# EAGLE design Bhoreal mini (EAGLE 7.7.0)

## Sheet 1 of 2
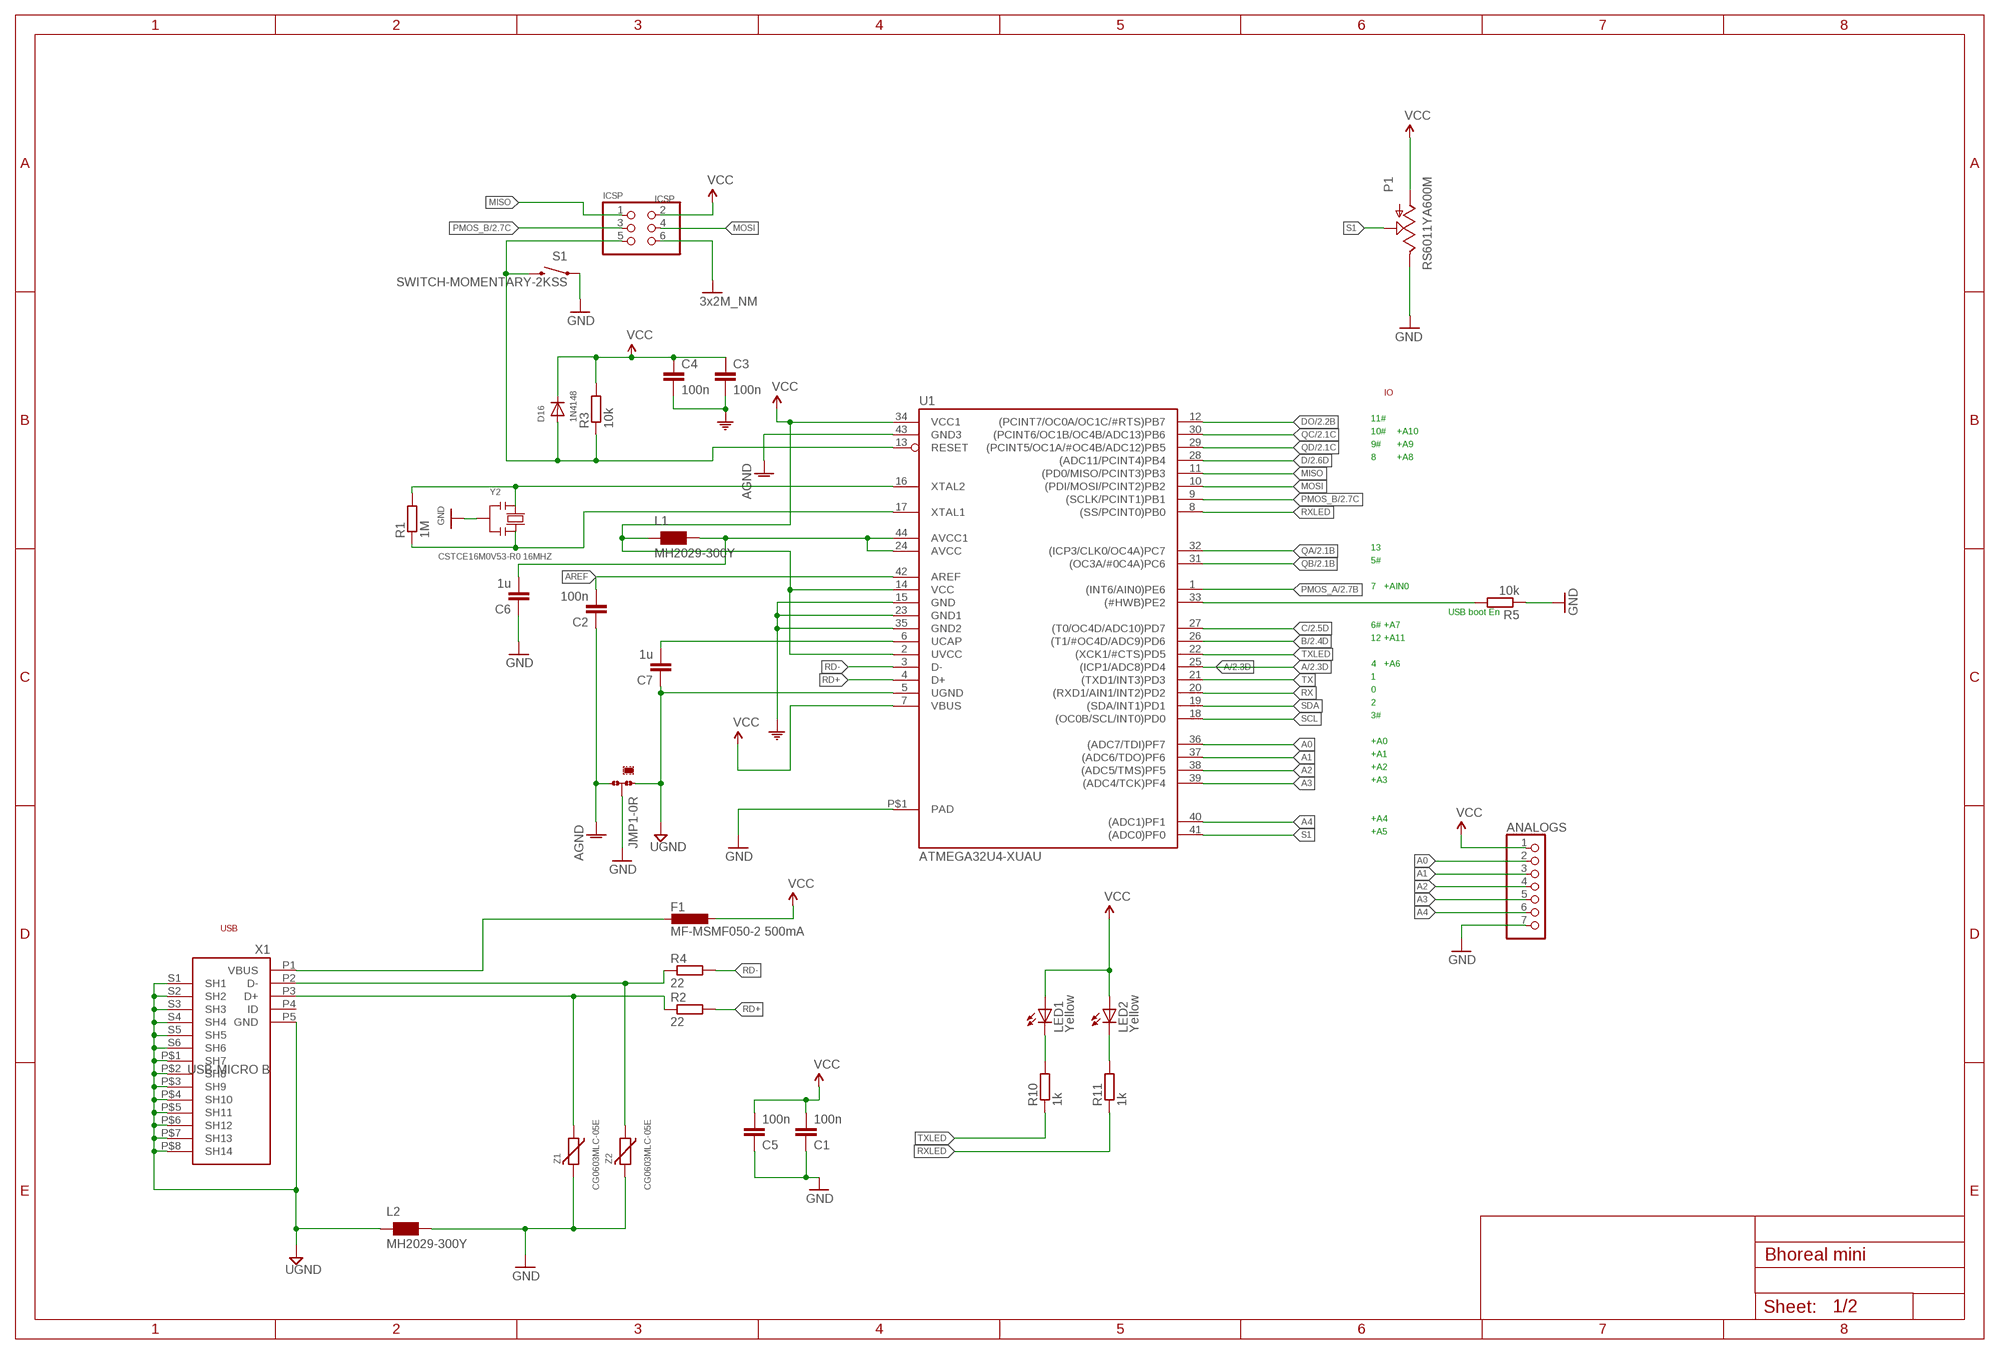
[diagram p0: schematic, sheet 1]

### Parts
ANALOGS  PINHD-1X7  [1X07]
C1  100n  C-EUC0603K  [C0603K]
C2  100n  C-EUC0603K  [C0603K]
C3  100n  C-EUC0603K  [C0603K]
C4  100n  C-EUC0603K  [C0603K]
C5  100n  C-EUC0603K  [C0603K]
C6  1u  C-EUC0805  [C0805]
C7  1u  C-EUC0805  [C0805]
D16  1N4148  DIODESOD-323F  [SOD-323F]
F1  MF-MSMF050-2 500mA  L-EUL1812  [L1812]
ICSP  ICSP  PINHD-2X3  [2X03]
JMP1  0R-JUMPC  [C0R-JMP]
L1  MH2029-300Y  WE-CBF_0805  [0805]
L2  MH2029-300Y  WE-CBF_0805  [0805]
LED1  Yellow  LEDCHIPLED_0805  [CHIPLED_0805]
LED2  Yellow  LEDCHIPLED_0805  [CHIPLED_0805]
P1  RS6011YA600M  [RS6011YA600M]
R1  1M  R-EU_R0603  [R0603]
R2  22  R-EU_R0603  [R0603]
R3  10k  R-EU_R0603  [R0603]
R4  22  R-EU_R0603  [R0603]
R5  10k  R-EU_R0603  [R0603]
R10  1k  R-EU_R0603  [R0603]
R11  1k  R-EU_R0603  [R0603]
S1  SWITCH-MOMENTARY-2KSS  [KSS241G]
U1  ATMEGA32U4-XUAU  [TQFP44-PAD]
X1  USB-MICRO B  MYCON2_USB-MINI-B  [CON2_USB_MICRO_B_AT]
Y2  CSTCE16M0V53-R0 16MHZ  RESONATORMU  [RESONATOR]
Z1  CG0603MLC-05E  VARISTORCN0603  [CT/CN0603]
Z2  CG0603MLC-05E  VARISTORCN0603  [CT/CN0603]

### Nets
A: U1.25((ICP1/ADC8)PD4) ; also sheet 2
A0: ANALOGS.2 U1.36((ADC7/TDI)PF7)
A1: ANALOGS.3 U1.37((ADC6/TDO)PF6)
A2: ANALOGS.4 U1.38((ADC5/TMS)PF5)
A3: ANALOGS.5 U1.39((ADC4/TCK)PF4)
A4: ANALOGS.6 U1.40((ADC1)PF1)
AGND: C2.1 JMP1.3 U1.43(GND3)
AREF [aref]: C2.2 U1.42(AREF)
AVCC: C6.2 L1.2 U1.24(AVCC) U1.44(AVCC1)
B: U1.26((T1/#OC4D/ADC9)PD6) ; also sheet 2
C: U1.27((T0/OC4D/ADC10)PD7) ; also sheet 2
D: U1.28((ADC11/PCINT4)PB4) ; also sheet 2
D+: R2.1 X1.P3(D+) Z1.1
D-: R4.1 X1.P2(D-) Z2.1
DO: U1.12((PCINT7/OC0A/OC1C/#RTS)PB7) ; also sheet 2
GND: ANALOGS.7 C1.1 C3.2 C4.2 C5.1 C6.1 ICSP.6 JMP1.2 L2.2 P1.2(E) R5.1 S1.1 U1.15(GND) U1.23(GND1) U1.35(GND2) U1.P$1(PAD) Y2.2 Z1.2 Z2.2 ; supply symbol labelled 3x2M_NM, COM ; also sheet 2
HWB: R5.2 U1.33((#HWB)PE2)
MISO: ICSP.1 U1.11((PD0/MISO/PCINT3)PB3)
MOSI: ICSP.4 U1.10((PDI/MOSI/PCINT2)PB2)
N$2 [usbvcc]: LED1.C R10.2
N$4 [usbvcc]: LED2.C R11.2
PMOS_A: U1.1((INT6/AIN0)PE6) ; also sheet 2
PMOS_B: ICSP.3 U1.9((SCLK/PCINT1)PB1) ; also sheet 2
QA: U1.32((ICP3/CLK0/OC4A)PC7) ; also sheet 2
QB: U1.31((OC3A/#0C4A)PC6) ; also sheet 2
QC: U1.30((PCINT6/OC1B/OC4B/ADC13)PB6) ; also sheet 2
QD: U1.29((PCINT5/OC1A/#OC4B/ADC12)PB5) ; also sheet 2
RD+: R2.2 U1.4(D+)
RD-: R4.2 U1.3(D-)
RESET: D16.A ICSP.5 R3.1 S1.2 U1.13(RESET)
RX: U1.20((RXD1/AIN1/INT2)PD2)
RXLED: R11.1 U1.8((SS/PCINT0)PB0)
S1: P1.1(S) U1.41((ADC0)PF0)
SCL: U1.18((OC0B/SCL/INT0)PD0)
SDA: U1.19((SDA/INT1)PD1)
TX: U1.21((TXD1/INT3)PD3)
TXLED: R10.1 U1.22((XCK1/#CTS)PD5)
UCAP: C7.2 U1.6(UCAP)
UGND [gnd]: C7.1 JMP1.1 L2.1 U1.5(UGND) X1.P5(GND) X1.P$1(SH7) X1.P$2(SH8) X1.P$3(SH9) X1.P$4(SH10) X1.P$5(SH11) X1.P$6(SH12) X1.P$7(SH13) X1.P$8(SH14) X1.S1(SH1) X1.S2(SH2) X1.S3(SH3) X1.S4(SH4) X1.S5(SH5) X1.S6(SH6)
VCC: ANALOGS.1 C1.2 C3.1 C4.1 C5.2 D16.C F1.1 ICSP.2 L1.1 LED1.A LED2.A P1.3(A) R3.2 U1.2(UVCC) U1.7(VBUS) U1.14(VCC) U1.34(VCC1) ; also sheet 2
XTAL3: R1.2 U1.16(XTAL2) Y2.1
XTAL4: R1.1 U1.17(XTAL1) Y2.3
XUSB [usbvcc]: F1.2 X1.P1(VBUS)
Unconnected: X1.P4(ID)

### Notes on the sheet
- IO
- 11#
- 10# | +A10
- 9# | +A9
- 8 | +A8
- 13
- 5#
- 7 | +AIN0
- USB boot En
- 6# | +A7
- 12 | +A11
- 4 | +A6
- 1
- 0
- 2
- 3#
- +A0
- +A1
- +A2
- +A3
- +A4
- +A5
- USB

## Sheet 2 of 2
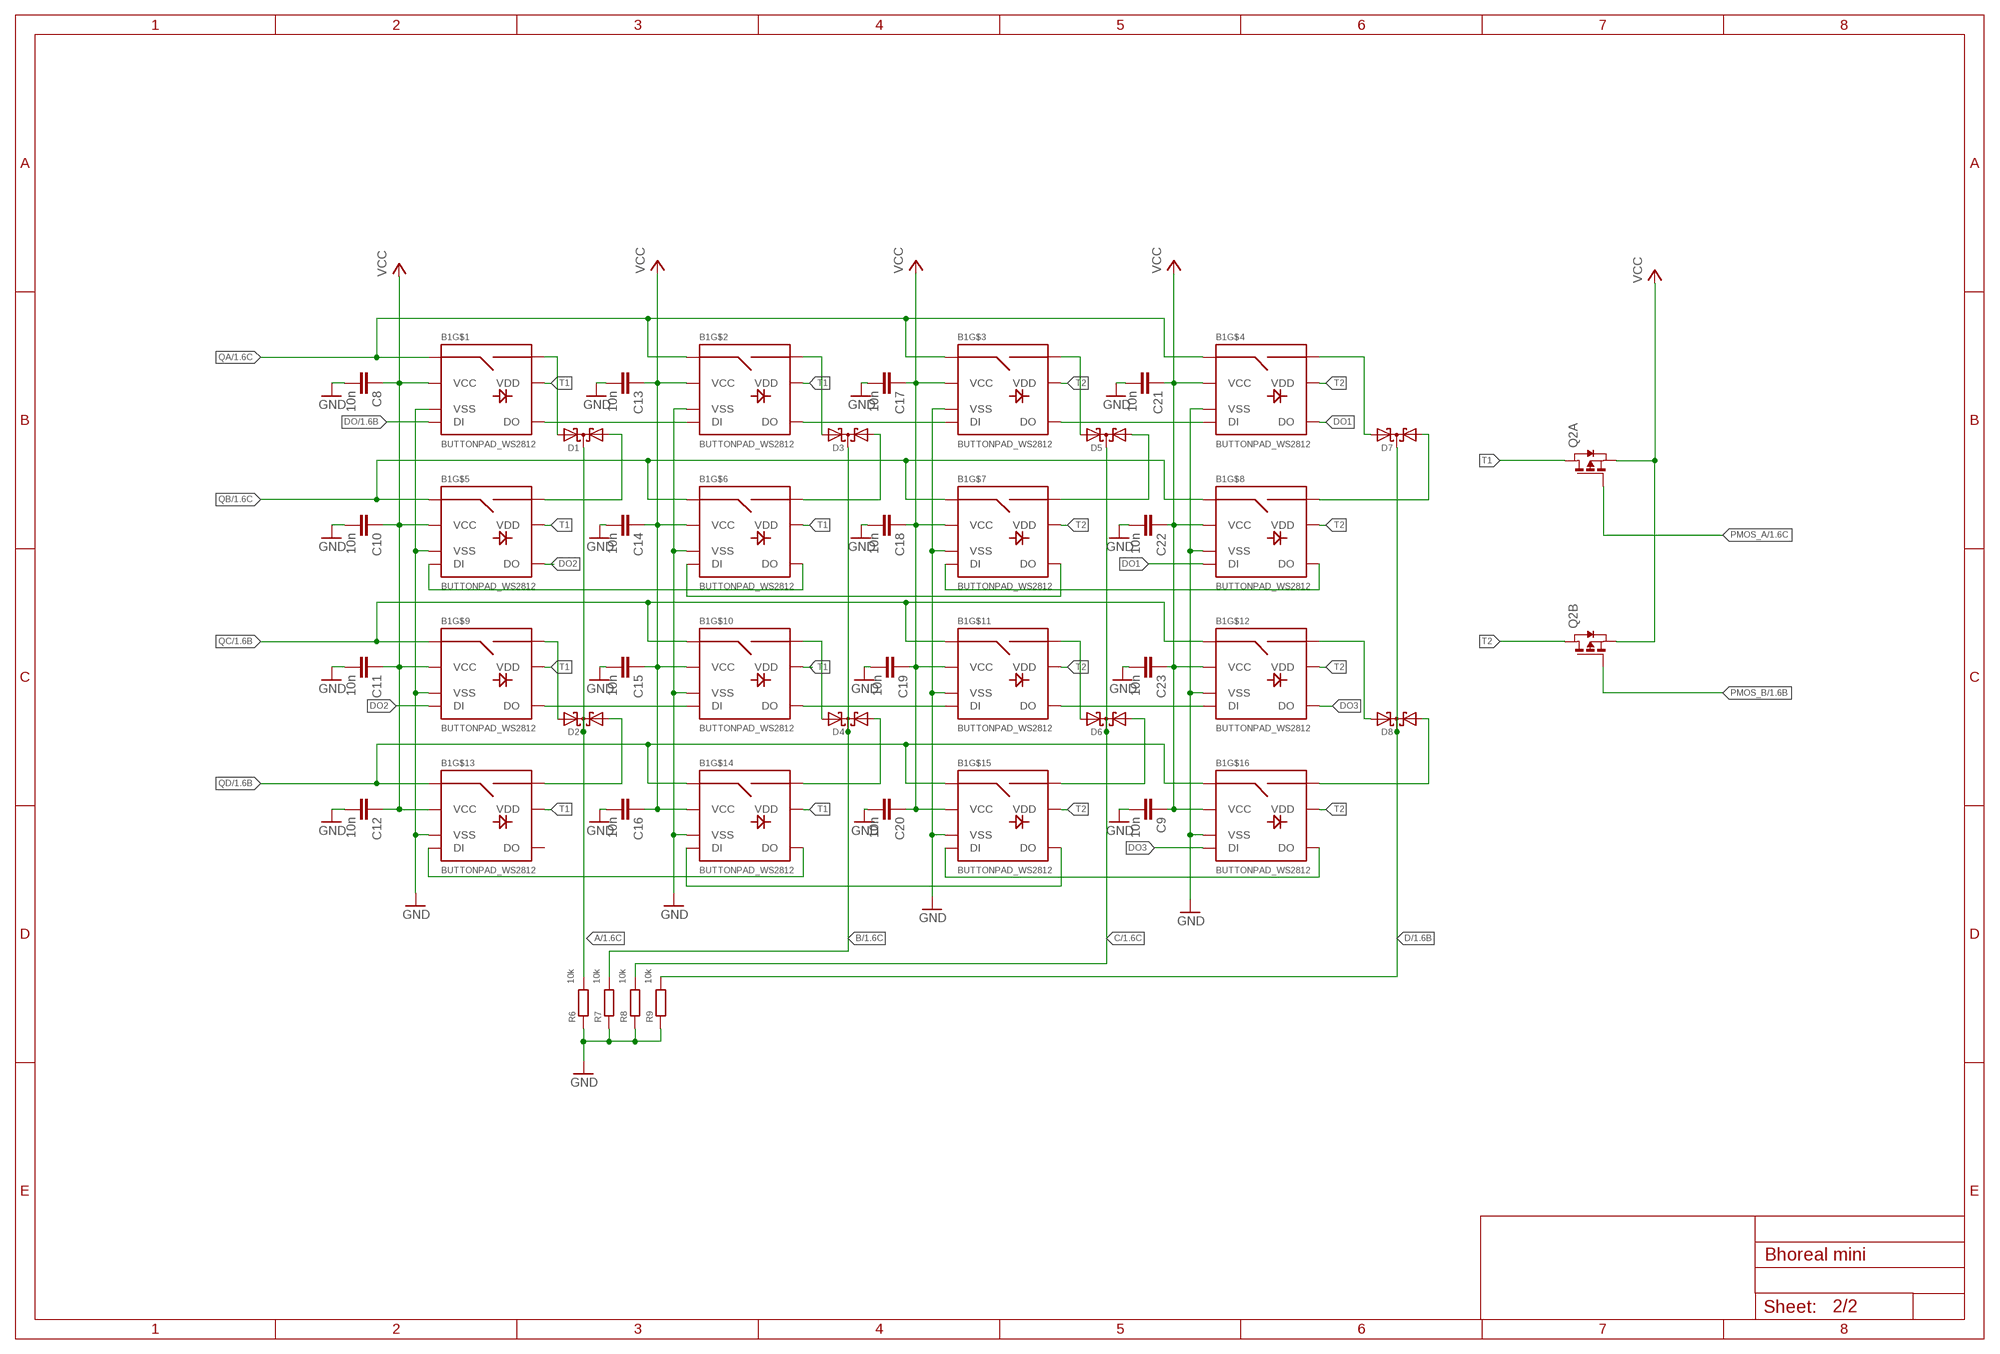
[diagram p1: schematic, sheet 2]

### Parts
B1  BUTTONPAD_WS2812  [BUTTONPAD_WS2812]
C8  10n  C-EUC0603  [C0603]
C9  10n  C-EUC0603  [C0603]
C10  10n  C-EUC0603  [C0603]
C11  10n  C-EUC0603  [C0603]
C12  10n  C-EUC0603  [C0603]
C13  10n  C-EUC0603  [C0603]
C14  10n  C-EUC0603  [C0603]
C15  10n  C-EUC0603  [C0603]
C16  10n  C-EUC0603  [C0603]
C17  10n  C-EUC0603  [C0603]
C18  10n  C-EUC0603  [C0603]
C19  10n  C-EUC0603  [C0603]
C20  10n  C-EUC0603  [C0603]
C21  10n  C-EUC0603  [C0603]
C22  10n  C-EUC0603  [C0603]
C23  10n  C-EUC0603  [C0603]
D1  BAS70-05  [SOT23]
D2  BAS70-05  [SOT23]
D3  BAS70-05  [SOT23]
D4  BAS70-05  [SOT23]
D5  BAS70-05  [SOT23]
D6  BAS70-05  [SOT23]
D7  BAS70-05  [SOT23]
D8  BAS70-05  [SOT23]
Q2  PMOS2SO8  [SO8]
R6  10k  R-EU_R0603  [R0603]
R7  10k  R-EU_R0603  [R0603]
R8  10k  R-EU_R0603  [R0603]
R9  10k  R-EU_R0603  [R0603]

### Nets
A: D1.3(C) D2.3(C) R6.2 ; also sheet 1
B: D3.3(C) D4.3(C) R7.2 ; also sheet 1
C: D5.3(C) D6.3(C) R8.2 ; also sheet 1
D: D7.3(C) D8.3(C) R9.2 ; also sheet 1
DO: B1.2A(DI) ; also sheet 1
DO1: B1.1D(DO) B1.2H(DI)
DO2: B1.1E(DO) B1.2I(DI)
DO3: B1.1L(DO) B1.2P(DI)
GND: B1.6A(VSS) B1.6B(VSS) B1.6C(VSS) B1.6D(VSS) B1.6E(VSS) B1.6F(VSS) B1.6G(VSS) B1.6H(VSS) B1.6I(VSS) B1.6J(VSS) B1.6K(VSS) B1.6L(VSS) B1.6M(VSS) B1.6N(VSS) B1.6O(VSS) B1.6P(VSS) C8.2 C9.2 C10.2 C11.2 C12.2 C13.2 C14.2 C15.2 C16.2 C17.2 C18.2 C19.2 C20.2 C21.2 C22.2 C23.2 R6.1 R7.1 R8.1 R9.1 ; also sheet 1
N$1: B1.SIG2A(SIG2) D1.2(A2)
N$3: B1.SIG2E(SIG2) D1.1(A1)
N$5: B1.SIG2I(SIG2) D2.2(A2)
N$6: B1.SIG2M(SIG2) D2.1(A1)
N$7: B1.SIG2B(SIG2) D3.2(A2)
N$8: B1.SIG2F(SIG2) D3.1(A1)
N$9: B1.SIG2J(SIG2) D4.2(A2)
N$10: B1.SIG2N(SIG2) D4.1(A1)
N$11: B1.SIG2C(SIG2) D5.2(A2)
N$12: B1.SIG2G(SIG2) D5.1(A1)
N$13: B1.SIG2K(SIG2) D6.2(A2)
N$14: B1.SIG2O(SIG2) D6.1(A1)
N$15: B1.SIG2L(SIG2) D8.2(A2)
N$16: B1.SIG2P(SIG2) D8.1(A1)
N$17: B1.SIG2D(SIG2) D7.2(A2)
N$18: B1.SIG2H(SIG2) D7.1(A1)
N$19: B1.1A(DO) B1.2B(DI)
N$20: B1.1F(DO) B1.2E(DI)
N$21: B1.1G(DO) B1.2F(DI)
N$22: B1.1B(DO) B1.2C(DI)
N$23: B1.1C(DO) B1.2D(DI)
N$24: B1.1H(DO) B1.2G(DI)
N$25: B1.1K(DO) B1.2L(DI)
N$26: B1.1J(DO) B1.2K(DI)
N$27: B1.1I(DO) B1.2J(DI)
N$28: B1.1P(DO) B1.2O(DI)
N$29: B1.1O(DO) B1.2N(DI)
N$30: B1.1N(DO) B1.2M(DI)
PMOS_A: Q2.2(A:G) ; also sheet 1
PMOS_B: Q2.4(B:G) ; also sheet 1
QA: B1.SIG1A(SIG1) B1.SIG1B(SIG1) B1.SIG1C(SIG1) B1.SIG1D(SIG1) ; also sheet 1
QB: B1.SIG1E(SIG1) B1.SIG1F(SIG1) B1.SIG1G(SIG1) B1.SIG1H(SIG1) ; also sheet 1
QC: B1.SIG1I(SIG1) B1.SIG1J(SIG1) B1.SIG1K(SIG1) B1.SIG1L(SIG1) ; also sheet 1
QD: B1.SIG1M(SIG1) B1.SIG1N(SIG1) B1.SIG1O(SIG1) B1.SIG1P(SIG1) ; also sheet 1
T1: B1.5A(VDD) B1.5B(VDD) B1.5E(VDD) B1.5F(VDD) B1.5I(VDD) B1.5J(VDD) B1.5M(VDD) B1.5N(VDD) Q2.7(A:D) Q2.8(A:D)
T2: B1.5C(VDD) B1.5D(VDD) B1.5G(VDD) B1.5H(VDD) B1.5K(VDD) B1.5L(VDD) B1.5O(VDD) B1.5P(VDD) Q2.5(B:D) Q2.6(B:D)
VCC: B1.3A(VCC) B1.3B(VCC) B1.3C(VCC) B1.3D(VCC) B1.3E(VCC) B1.3F(VCC) B1.3G(VCC) B1.3H(VCC) B1.3I(VCC) B1.3J(VCC) B1.3K(VCC) B1.3L(VCC) B1.3M(VCC) B1.3N(VCC) B1.3O(VCC) B1.3P(VCC) C8.1 C9.1 C10.1 C11.1 C12.1 C13.1 C14.1 C15.1 C16.1 C17.1 C18.1 C19.1 C20.1 C21.1 C22.1 C23.1 Q2.1(A:S) Q2.3(B:S) ; also sheet 1
Unconnected: B1.1M(DO)

## Library data of the parts
ANALOGS = pinhead:PINHD-1X7: PIN HEADER
B1 = Hangar:BUTTONPAD_WS2812
C1-C7 = SmartPrj:C-EU: CAPACITOR, European symbol
C8-C23 = rcl:C-EU: CAPACITOR, European symbol
D1-D8 = diode:BAS70-05: Silicon Schottky Diodes General-purpose diode for high-speed switching
D16 = adafruit:DIODE: Diode SMADIODE - SMA Surface Mount Package 20V 1A Schottky Diode Digikey: 641-1014-6-ND DO-1N4148 - Through Hole Small Current Diode SOD-123 20V 1 A (.5mV Vf) Schottky Diode - Digikey: MBRX120TPMSCT-ND SOD-323 10V 570mA (.38mV Vf, 3ns) Schottky Diode - Digikey: ZLLS410CT-ND SOD-523 30V 30mA Schottky Diode (RB751S-40TE61) - Digikey: RB751S-40TE61CT-ND SOT23-R/W - SOT23 Package (R = Solder Paste/Reflow Ovens, W = Hand-Soldering) BAT54Film 40V 300mA - Digikey: 497-7162-1-ND
F1 = rcl:L-EU: INDUCTOR, European symbol
ICSP = SmartPrj:PINHD-2X3: PIN HEADER
JMP1 = Hangar:0R-JUMP: SMD 0R 0805 Jumper
L1 L2 = wuerth-elektronik:WE-CBF: SMD EMI Suppression Ferrite Beads - excellent anti-EMI properties - low DCR - impedances till 3000 ohms - rated current up to 6 A
LED1 LED2 = led:LED: LED OSRAM: - CHIPLED LG R971, LG N971, LY N971, LG Q971, LY Q971, LO R971, LY R971 LH N974, LH R974 LS Q976, LO Q976, LY Q976 LO Q996 - Hyper CHIPLED LW Q18S LB Q993, LB Q99A, LB R99A - SideLED LS A670, LO A670, LY A670, LG A670, LP A670 LB A673, LV A673, LT A673, LW A673 LH A674 LY A675 LS A676, LA A676, LO A676, LY A676, LW A676 LS A679, LY A679, LG A679 - Hyper Micro SIDELED® LS Y876, LA Y876, LO Y876, LY Y876 LT Y87S - SmartLED LW L88C, LW L88S LB L89C, LB L89S, LG L890 LS L89K, LO L89K, LY L89K LS L896, LA L896, LO L896, LY L896 - TOPLED LS T670, LO T670, LY T670, LG T670, LP T670 LSG T670, LSP T670, LSY T670, LOP T670, LYG T670 LG T671, LOG T671, LSG T671 LB T673, LV T673, LT T673, LW T673 LH T674 LS T676, LA T676, LO T676, LY T676, LB T676, LH T676, LSB T676, LW T676 LB T67C, LV T67C, LT T67C, LS T67K, LO T67K, LY T67K, LW E67C LS E67B, LA E67B, LO E67B, LY E67B, LB E67C, LV E67C, LT E67C LW T67C LS T679, LY T679, LG T679 LS T770, LO T770, LY T770, LG T770, LP T770 LB T773, LV T773, LT T773, LW T773 LH T774 LS E675, LA E675, LY E675, LS T675 LS T776, LA T776, LO T776, LY T776, LB T776 LHGB T686 LT T68C, LB T68C - Hyper Mini TOPLED® LB M676 - Mini TOPLED Santana® LG M470 LS M47K, LO M47K, LY M47K Source: http://www.osram.convergy.de LUXEON: - LUMILED® LXK2-PW12-R00, LXK2-PW12-S00, LXK2-PW14-U00, LXK2-PW14-V00 LXK2-PM12-R00, LXK2-PM12-S00, LXK2-PM14-U00 LXK2-PE12-Q00, LXK2-PE12-R00, LXK2-PE12-S00, LXK2-PE14-T00, LXK2-PE14-U00 LXK2-PB12-K00, LXK2-PB12-L00, LXK2-PB12-M00, LXK2-PB14-N00, LXK2-PB14-P00, LXK2-PB14-Q00 LXK2-PR12-L00, LXK2-PR12-M00, LXK2-PR14-Q00, LXK2-PR14-R00 LXK2-PD12-Q00, LXK2-PD12-R00, LXK2-PD12-S00 LXK2-PH12-R00, LXK2-PH12-S00 LXK2-PL12-P00, LXK2-PL12-Q00, LXK2-PL12-R00 Source: www.luxeon.com KINGBRIGHT: KA-3528ASYC Source: www.kingbright.com
P1 = Hangar:RS6011YA600M
Q2 = zetex:PMOS2: DUAL 30V P-CHANNEL ENHANCEMENT MODE MOSFET Source: Data sheet <http://www.diodes.com/datasheets/ZXMP3A16DN8.pdf> SOP8 Source: Data sheet <http://www.diodes.com/datasheets/ZXMD63P03X.pdf> MSOP8; OC_FARNELL: unknown; OC_NEWARK: unknown
R1-R11 = rcl:R-EU_: RESISTOR, European symbol
S1 = Hangar:SWITCH-MOMENTARY-2
U1 = SmartPrj:ATMEGA32U4-XU
X1 = SmartPrj:MYCON2_USB-MINI-B
Y2 = SmartPrj:RESONATOR
Z1 Z2 = varistor:VARISTOR: VARISTOR

## Net classes
0 default: width 0.203 mm, drill 0.305 mm, clearance 0.203 mm
1 Power: width 0.406 mm
2 gnd: width 0.254 mm, drill 0.6 mm, clearance 0.203 mm
3 usbvcc: width 0.254 mm, drill 0.6 mm, clearance 0.203 mm
4 aref: width 0.254 mm, drill 0.6 mm, clearance 0.203 mm

## Board
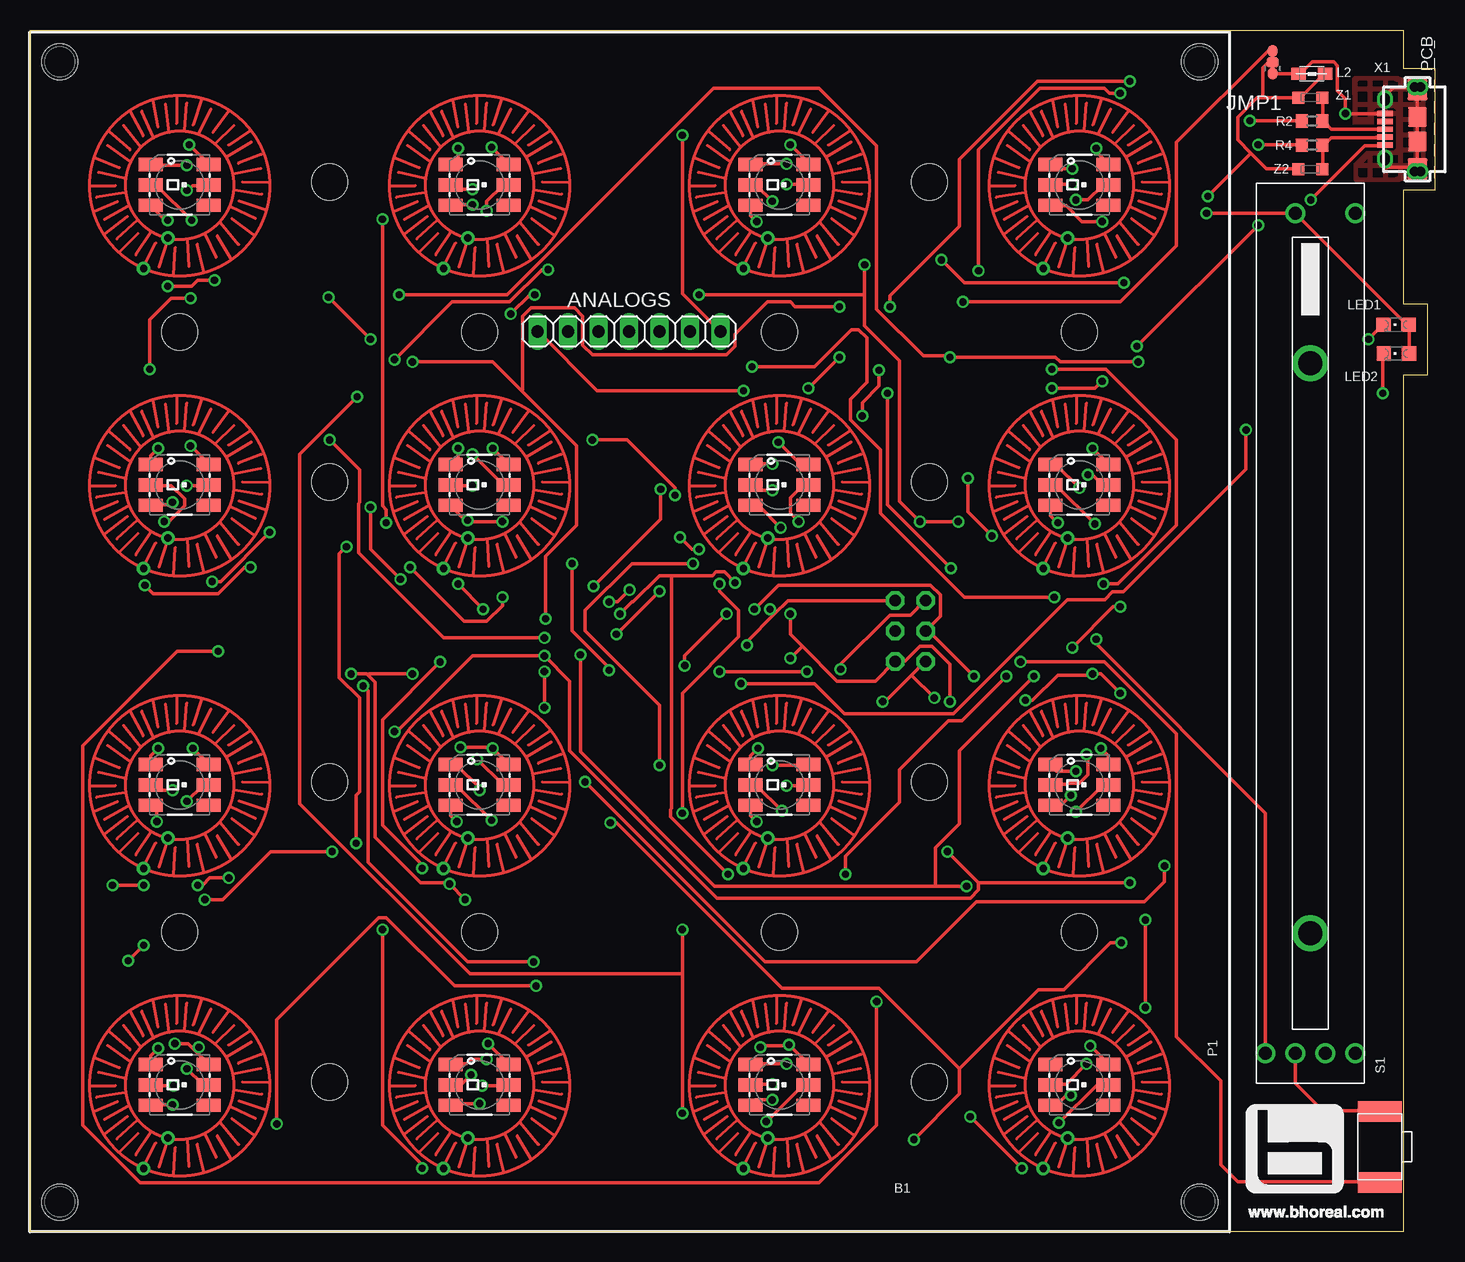
[diagram p2: board, top side]
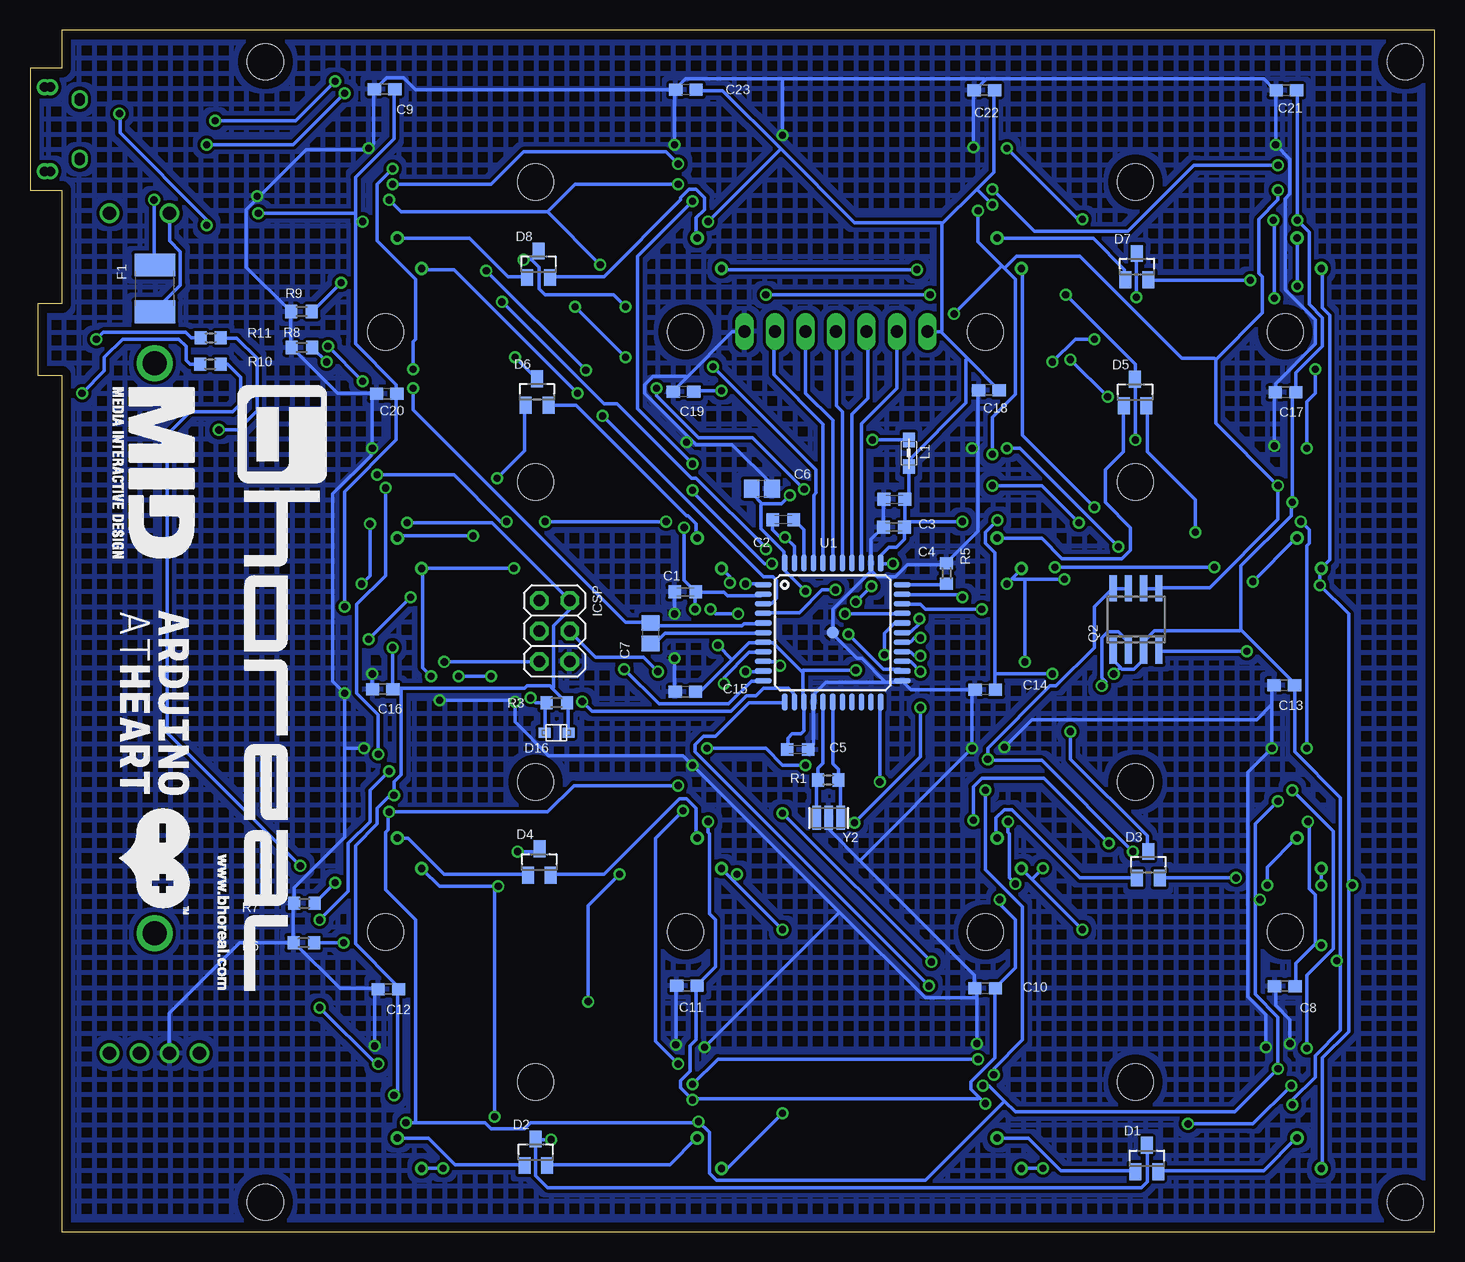
[diagram p3: board, bottom side, seen from below]

Size 117.12 x 100.16 mm. Coordinates in mm from the lower left corner, seen from the top.
Outline: 0,0 0,100.16 114.48,100.16 114.48,96.97 117.12,96.97 117.12,86.8 114.48,86.8 114.48,77.34 116.48,77.34 116.48,71.38 114.48,71.38 114.48,0 0,0
Copper layers (1*16): Top 0.035mm / dielectric 1.5mm / Bottom 0.035mm
Design rules "default *": minimum track width 12mil, minimum drill 0.6mm, track to track 10mil, track to pad 10mil, pad to pad 10mil, via to via 10mil, smd to smd 10mil, copper to edge 30mil, drill to drill 20mil, minimum pad ring 10mil, minimum via ring 0.2mm, stop-mask expansion 5mil, vias tented up to drill 0mil, thermal gap 10mil

### Footprints (pad centres in the part's own frame; a part is rotated, then mirrored left to right if it is on the bottom)
1X07 = drill 1.016 long: 1 -7.62,0; 2 -5.08,0; 3 -2.54,0; 4 0,0; 5 2.54,0; 6 5.08,0; 7 7.62,0
BUTTONPAD_WS2812 = smd 1.1 x 2: 1A 13.95,89.9; 1B 38.95,89.9; 1C 63.95,89.9; 1D 88.95,89.9; 1E 13.95,64.9; 1F 38.95,64.9; 1G 63.95,64.9; 1H 88.95,64.9; 1I 13.95,39.9; 1J 38.95,39.9; 1K 63.95,39.9; 1L 88.95,39.9; 1M 13.95,14.9; 1N 38.95,14.9; 1O 63.95,14.9; 1P 88.95,14.9; 2A 12.25,89.9; 2B 37.25,89.9; 2C 62.25,89.9; 2D 87.25,89.9; 2E 12.25,64.9; 2F 37.25,64.9; 2G 62.25,64.9; 2H 87.25,64.9; 2I 12.25,39.9; 2J 37.25,39.9; 2K 62.25,39.9; 2L 87.25,39.9; 2M 12.25,14.9; 2N 37.25,14.9; 2O 62.25,14.9; 2P 87.25,14.9; 3A 10.55,89.9; 3B 35.55,89.9; 3C 60.55,89.9; 3D 85.55,89.9; 3E 10.55,64.9; 3F 35.55,64.9; 3G 60.55,64.9; 3H 85.55,64.9; 3I 10.55,39.9; 3J 35.55,39.9; 3K 60.55,39.9; 3L 85.55,39.9; 3M 10.55,14.9; 3N 35.55,14.9; 3O 60.55,14.9; 3P 85.55,14.9; 4A 10.55,85.1; 4B 35.55,85.1; 4C 60.55,85.1; 4D 85.55,85.1; 4E 10.55,60.1; 4F 35.55,60.1; 4G 60.55,60.1; 4H 85.55,60.1; 4I 10.55,35.1; 4J 35.55,35.1; 4K 60.55,35.1; 4L 85.55,35.1; 4M 10.55,10.1; 4N 35.55,10.1; 4O 60.55,10.1; 4P 85.55,10.1; 5A 12.25,85.1; 5B 37.25,85.1; 5C 62.25,85.1; 5D 87.25,85.1; 5E 12.25,60.1; 5F 37.25,60.1; 5G 62.25,60.1; 5H 87.25,60.1; 5I 12.25,35.1; 5J 37.25,35.1; 5K 62.25,35.1; 5L 87.25,35.1; 5M 12.25,10.1; 5N 37.25,10.1; 5O 62.25,10.1; 5P 87.25,10.1; 6A 13.95,85.1; 6B 38.95,85.1; 6C 63.95,85.1; 6D 88.95,85.1; 6E 13.95,60.1; 6F 38.95,60.1; 6G 63.95,60.1; 6H 88.95,60.1; 6I 13.95,35.1; 6J 38.95,35.1; 6K 63.95,35.1; 6L 88.95,35.1; 6M 13.95,10.1; 6N 38.95,10.1; 6O 63.95,10.1; 6P 88.95,10.1 | drill 0.6: SIG1A 5.287,90.51; SIG1B 30.287,90.51; SIG1C 55.287,90.51; SIG1D 80.287,90.51; SIG1E 5.287,65.51; SIG1F 30.287,65.51; SIG1G 55.287,65.51; SIG1H 80.287,65.51; SIG1I 5.287,40.51; SIG1J 30.287,40.51; SIG1K 55.287,40.51; SIG1L 80.287,40.51; SIG1M 5.287,15.51; SIG1N 30.287,15.51; SIG1O 55.287,15.51; SIG1P 80.287,15.51; SIG2A 7.827,88.478; SIG2B 32.827,88.478; SIG2C 57.827,88.478; SIG2D 82.827,88.478; SIG2E 7.827,63.478; SIG2F 32.827,63.478; SIG2G 57.827,63.478; SIG2H 82.827,63.478; SIG2I 7.827,38.478; SIG2J 32.827,38.478; SIG2K 57.827,38.478; SIG2L 82.827,38.478; SIG2M 7.827,13.478; SIG2N 32.827,13.478; SIG2O 57.827,13.478; SIG2P 82.827,13.478 | hole 3: 12.499,24.997; 24.999,37.497; 37.499,24.997; 24.999,12.497; 62.499,24.997; 74.999,37.497; 87.499,24.997; 74.999,12.497; 12.499,74.997; 24.999,87.497; 37.499,74.997; 24.999,62.497; 62.499,74.997; 74.999,87.497; 87.499,74.997; 74.999,62.497; 2.483,97.513; 97.515,97.513; 97.515,2.481; 2.483,2.481
C0603K = smd 1.05 x 1.08: 1 -0.875,0; 2 0.875,0
C0805 = smd 1.3 x 1.5: 1 -0.85,0; 2 0.85,0
C0603 = smd 1.1 x 1: 1 -0.85,0; 2 0.85,0
SOT23 = smd 1 x 1.4: 1 -0.95,-1.1; 2 0.95,-1.1; 3 0,1.1
SOD-323F = smd 1 x 0.8: A -1,0; C 1,0
L1812 = smd 1.9 x 3.4: 1 -1.95,0; 2 1.95,0
2X03 = drill 0.95 pad 1.55 octagon: 1 -2.54,-1.27; 2 -2.54,1.27; 3 0,-1.27; 4 0,1.27; 5 2.54,-1.27; 6 2.54,1.27
C0R-JMP = smd 0.8 x 1: 1 0,0.938; 3 0,-0.938 | smd 1 x 0.8: 2 0,0
0805 = smd 1.2 x 1: 1 -1.1,0; 2 1.1,0
CHIPLED_0805 = smd 1.2 x 1.2: A 0,-1.05; C 0,1.05
RS6011YA600M = drill 1.1: 1 -35,3.75; 2 -35,1.25; 3 35,1.25; L1 -35,-1.25; L2 -35,-3.75; L3 35,-3.75 | drill 2: P$5 -25,0; P$6 22.5,0
SO8 = smd 0.6 x 2.2: 1 -1.905,-2.6; 2 -0.635,-2.6; 3 0.635,-2.6; 4 1.905,-2.6; 5 1.905,2.6; 6 0.635,2.6; 7 -0.635,2.6; 8 -1.905,2.6
R0603 = smd 1 x 1.1: 1 -0.85,0; 2 0.85,0
KSS241G = smd 1.7 x 3.7: 1 -2.95,0; 2 2.95,0
TQFP44-PAD = smd 1.4 x 0.45: 1 -5.8,4; 2 -5.8,3.2; 3 -5.8,2.4; 4 -5.8,1.6; 5 -5.8,0.8; 6 -5.8,0; 7 -5.8,-0.8; 8 -5.8,-1.6; 9 -5.8,-2.4; 10 -5.8,-3.2; 11 -5.8,-4; 23 5.8,-4; 24 5.8,-3.2; 25 5.8,-2.4; 26 5.8,-1.6; 27 5.8,-0.8; 28 5.8,0; 29 5.8,0.8; 30 5.8,1.6; 31 5.8,2.4; 32 5.8,3.2; 33 5.8,4 | smd 0.45 x 1.4: 12 -4,-5.8; 13 -3.2,-5.8; 14 -2.4,-5.8; 15 -1.6,-5.8; 16 -0.8,-5.8; 17 0,-5.8; 18 0.8,-5.8; 19 1.6,-5.8; 20 2.4,-5.8; 21 3.2,-5.8; 22 4,-5.8; 34 4,5.8; 35 3.2,5.8; 36 2.4,5.8; 37 1.6,5.8; 38 0.8,5.8; 39 0,5.8; 40 -0.8,5.8; 41 -1.6,5.8; 42 -2.4,5.8; 43 -3.2,5.8; 44 -4,5.8 | smd 1 x 1: P$1 0,0
CON2_USB_MICRO_B_AT = smd 0.406 x 1.346: P1 -1.321,2.692; P2 -0.66,2.692; P3 0,2.692; P4 0.66,2.692; P5 1.321,2.692 | drill 0.8 pad 1.27: P$1 -2.616,2.692 | drill 0.8 pad 1.245: P$2 -2.362,2.692; P$7 2.362,2.692; P$8 2.616,2.692 | drill 0.8 pad 1.143: P$3 -3.505,-0.254; P$4 -3.505,0.254; P$5 3.505,0.254; P$6 3.505,-0.254 | smd 1.778 x 1.651: S1 -3.302,0; S2 3.302,0 | smd 1.524 x 1.27: S3 -2.489,2.692; S4 2.489,2.692 | smd 1.626 x 1.524: S5 -1.016,0; S6 1.016,0
RESONATOR = smd 0.7 x 2: 1 -1,0; 2 0,0; 3 1,0
CT/CN0603 = smd 1 x 1: 1 -1,0; 2 1,0

### Placement (x,y rotation side)
ANALOGS  49.94,75.04 0 top
B1  99.98,0 90 top
C1  62.5,53.34 0 bottom
C2  54.34,59.36 0 bottom
C3  45.06,61.04 180 bottom
C4  45.1,58.74 180 bottom
C5  53.12,40.2 180 bottom
C6  56.12,61.94 180 bottom
C7  65.38,49.88 270 bottom
C8  12.52,20.48 180 bottom
C9  87.56,95.24 180 bottom
C10  37.5,20.3 180 bottom
C11  62.36,20.5 180 bottom
C12  87.24,20.24 180 bottom
C13  12.56,45.54 180 bottom
C14  37.48,45.18 180 bottom
C15  62.48,45 180 bottom
C16  87.72,45.22 180 bottom
C17  12.46,69.96 180 bottom
C18  37.18,70.16 180 bottom
C19  62.64,70.02 180 bottom
C20  87.38,69.84 180 bottom
C21  12.38,95.12 180 bottom
C22  37.56,95.14 180 bottom
C23  62.44,95.18 180 bottom
D1  24.02,6.12 0 bottom
D2  74.96,6.64 0 bottom
D3  23.9,30.6 0 bottom
D4  74.66,30.82 0 bottom
D5  25,69.96 0 bottom
D6  74.86,70 0 bottom
D7  24.84,80.44 0 bottom
D8  74.72,80.64 0 bottom
D16  73.24,41.6 0 bottom
F1  106.7,78.62 90 bottom
ICSP  73.4,50.08 270 bottom
JMP1  103.58,97.46 180 top
L1  43.86,64.9 90 bottom
L2  106.86,96.5 0 top
LED1  113.9,73.2 90 top
LED2  113.88,75.6 90 top
P1  106.74,49.88 90 top
Q2  24.92,51.04 0 bottom
R1  50.58,37.66 180 bottom
R2  106.88,92.58 180 top
R3  73.22,44.1 0 bottom
R4  106.88,90.56 180 top
R5  40.72,54.88 270 bottom
R6  94.3,24.1 0 bottom
R7  94.24,27.38 0 bottom
R8  94.46,73.7 0 bottom
R9  94.48,76.7 0 bottom
R10  102.08,72.31 180 bottom
R11  102.05,74.51 180 bottom
S1  112.52,7.08 270 top
U1  50.2,49.94 0 bottom
X1  115.66,91.89 90 top
Y2  50.54,34.5 0 bottom
Z1  106.72,94.52 180 top
Z2  106.72,88.56 180 top

### Tracks (layer width: path | path; a pad name or v marks a point on that pad's centre or on a via)
A  (via drill 0.6)
  Top 0.305: v90.98,24.1 90.08,24.1 86.18,20.2 84.08,20.2 77.48,13.6 | 77.48,13.6 77.48,11.5 v73.68,7.7 | v42.88,43.7 v42.88,46.7 | v48.38,34.1 48.88,34.1 62.68,20.3 70.78,20.3 77.48,13.6
  Bottom 0.305: v90.98,24.1 R6.2 | v73.68,7.7 74.88,7.7 D2.3 74.98,7.6 74.98,4.7 73.98,3.7 24.48,3.7 23.98,4.2 23.98,7.2 D1.3 | v42.88,46.7 43.68,47.5 44.38,47.5 U1.25 | v42.88,43.7 42.88,39.6 v48.38,34.1
A0
  Bottom 0.305: U1.36 47.8,67.36 44.86,70.3 ANALOGS.2
A1
  Bottom 0.305: U1.37 48.6,68.14 47.28,69.46 47.28,74.92 ANALOGS.3
A2
  Bottom 0.305: U1.38 49.4,68.36 49.9,68.86 49.9,75 ANALOGS.4
A3
  Bottom 0.305: U1.39 50.2,67.62 52.48,69.9 ANALOGS.5
A4
  Bottom 0.305: U1.40 51,67.32 55.12,71.44 55.12,74.94 ANALOGS.6
AGND  (via drill 0.6)
  Top 0.305: JMP1.3 103.18,98.4 95.58,90.8 95.58,82.2 90.88,77.5 v77.78,77.5 | v55.78,56.9 55.18,56.9 v54.18,57.9
  Top 0.406: JMP1.3 | JMP1.3
  Bottom 0.305: U1.43 53.4,57.12 54.08,57.8 | 54.08,57.8 54.5,57.8 55.22,58.52 C2.1 | v77.78,77.5 69.28,69 68.18,69 61.98,62.8 61.58,62.8 55.78,57 v55.78,56.9 | v54.18,57.9 54.08,57.8
AREF
  Bottom 0.305: U1.42 52.6,58.49 C2.2
AVCC  (via drill 0.6)
  Top 0.305: v46.88,66 49.78,66 53.78,62 v53.78,61.4 | v52.48,53.4 v48.88,49.8
  Bottom 0.305: v46.88,66 L1.2 | v53.78,61.4 54.48,60.7 56.08,60.7 | 56.08,60.7 56.88,61.5 56.88,61.9 C6.2 | 44.48,46.8 U1.24 44.58,46.9 45.98,46.9 v48.88,49.8 | v52.48,53.4 54.18,55.1 54.18,55.7 U1.44 54.28,55.8 54.28,56.7 56.18,58.6 56.18,60.6 56.08,60.7
B  (via drill 0.6)
  Top 0.305: 79.08,29.1 v91.68,29.1 | v76.48,31.7 79.08,29.1 | v30.38,41.7 30.58,41.7 36.88,48 v42.88,48 44.98,45.9 44.98,40.1 57.28,27.8 78.38,27.8 79.08,28.5 79.08,29.1
  Bottom 0.305: v91.68,29.1 93.38,27.4 R7.2 | v76.48,31.7 74.88,31.7 D4.3 | v30.38,41.7 30.38,39.4 23.98,33 23.98,31.7 D3.3 | v42.88,48 43.38,48 43.68,48.3 44.38,48.3 U1.26
C  (via drill 0.6)
  Top 0.305: v92.38,72.5 85.88,72.5 85.48,72.9 v76.68,72.9 76.58,73 74.48,73 70.58,76.9 70.58,90.5 65.78,95.3 56.98,95.3 39.78,78.1 v30.78,78.1 | v24.98,66 27.48,63.5 27.48,60.8 27.38,60.7 27.38,56.6 34.48,49.5 v42.88,49.5
  Bottom 0.305: v92.38,72.5 93.58,73.7 R8.2 | v76.68,72.9 74.88,71.1 D6.3 | v24.98,66 24.98,71 D5.3 24.98,71.2 24.98,72.3 v30.78,78.1 | v42.88,49.5 43.38,49.5 43.68,49.2 44.38,49.2 U1.27
D  (via drill 0.6)
  Top 0.305: v91.18,79.1 77.88,79.1 v75.98,81 | v42.98,51.1 42.98,56.3 45.58,58.9 45.58,65.5 40.98,70.1 | 40.98,70.1 38.58,72.5 v31.88,72.5 | v24.88,77.9 v28.38,74.4 | v67.48,77.1 63.78,77.1 63.38,77.5 61.48,77.5 58.78,74.8 58.78,73.8 58.08,73.1 46.88,73.1 46.08,73.9 46.08,76.3 45.38,77 41.78,77 41.08,76.3 41.08,70.2 40.98,70.1
  Bottom 0.305: v91.18,79.1 93.58,76.7 R9.2 | v75.98,81 75.48,81 75.38,81.1 | 75.38,81.1 74.78,81.7 D8.3 | v42.98,51.1 42.98,50.7 43.68,50 44.38,50 U1.28 | v31.88,72.5 29.98,74.4 v28.38,74.4 | v24.88,77.9 24.88,81.5 D7.3 | 75.38,81.1 74.68,80.4 74.68,78.6 74.18,78.1 68.48,78.1 v67.48,77.1
D+
  Top 0.254: X1.P3 112.78,91.89 112.78,91.9
  Top 0.305: Z1.1 107.78,94.5 107.78,92.6 R2.1 107.88,92.5 108.48,91.9 112.78,91.9
D-
  Top 0.254: X1.P2 112.2,91.23 112.2,91.2
  Top 0.305: Z2.1 107.78,88.6 107.78,90.5 R4.1 107.88,90.6 108.48,91.2 112.2,91.2 112.78,91.2
DO  (via drill 0.6)
  Top 0.305: v42.18,20.5 35.38,20.5 29.68,26.2 29.08,26.2 20.58,17.7 v20.58,9 | v11.98,12.2 10.08,12.2 B1.2A
  Bottom 0.305: v42.18,20.5 61.68,40 61.68,40.6 60.98,41.3 59.98,41.3 57.18,44.1 54.28,44.1 U1.12 | v20.58,9 15.18,9 v11.98,12.2
DO1  (via drill 0.6)
  Top 0.305: v13.08,88.9 10.08,88.9 B1.1D | v36.88,86.9 35.38,86.9 35.08,87.2 B1.2H
  Bottom 0.305: v13.08,88.9 20.08,88.9 25.58,83.4 33.38,83.4 v36.88,86.9
DO2  (via drill 0.6)
  Top 0.305: v38.08,14.4 36.78,14.4 36.38,14 35.08,14 B1.1E | v61.88,12.3 60.08,12.3 B1.2I
  Bottom 0.305: v38.08,14.4 59.78,14.4 v61.88,12.3
DO3  (via drill 0.6)
  Top 0.305: v86.88,87.3 85.08,87.3 B1.2P | v63.08,89 60.08,89 B1.1L
  Bottom 0.305: v86.88,87.3 78.68,87.3 75.98,90 64.08,90 v63.08,89
GND  (via drill 0.6)
  Top 0.305: v12.08,15.7 13.18,15.7 13.78,15.1 | 13.78,15.1 14.88,14 B1.6A | v13.58,40.3 14.88,39 B1.6B | v14.08,15.4 13.78,15.1 | v38.58,65.3 39.88,64 B1.6G | B1.6F 39.88,39 v38.58,40.3 38.48,40.4 v35.88,40.4 | v63.38,51.5 63.38,49.8 64.38,48.8 | 64.38,48.8 67.28,45.9 70.48,45.9 72.08,47.5 ICSP.6 72.18,47.6 72.98,47.6 74.18,48.8 75.18,48.8 76.68,47.3 v76.68,44.2 | 64.38,48.8 v63.38,47.8 | B1.6I 64.88,14 v63.28,15.6 63.18,15.5 60.98,15.5 v60.88,15.4 | v38.18,15.7 39.88,14 B1.6E | v61.88,38.9 64.88,38.9 B1.6J | v62.38,65.8 64.18,64 64.88,64 B1.6K | v63.38,90.6 64.88,89.1 B1.6L | v38.48,90.4 39.88,89 B1.6H | v13.38,65.5 14.88,64 B1.6C | v13.28,90.6 14.88,89 B1.6D | v54.38,91.4 54.38,78.2 57.48,75.1 ANALOGS.7 | 101.78,89.9 100.68,91 100.68,92.9 102.28,94.5 102.78,94.5 | 101.78,89.9 103.08,88.6 105.68,88.6 Z2.2 | 102.78,94.5 105.68,94.5 Z1.2 105.78,94.4 107.88,96.5 107.98,96.5 L2.2 | 103.58,97.5 103.28,97.5 102.78,97 102.78,94.5 | v88.88,90.3 88.88,90 89.88,89 B1.6P | v88.58,65.3 89.88,64 B1.6O | v98.18,86.3 101.78,89.9 | v90.88,44.9 89.28,46.5 v88.58,46.5 88.48,46.4 85.68,46.4 83.58,44.3 v82.98,44.3 | v88.38,15.5 89.88,14 B1.6M | B1.6N 89.88,39.7 v89.28,40.3 | S1.1 112.48,10.1 107.78,10.1 105.49,12.39 P1.2
  Top 0.406: JMP1.2 103.58,97.5
  Bottom 0.305: C3.2 45.97,61 C4.2 47,57.72 U1.35 46.98,55.6 46.98,55.1 | C5.1 51.8,40.65 U1.15 51.68,44.2 51.68,44.9 50.78,45.8 45.88,45.8 | v12.08,15.7 12.08,17.7 13.28,18.9 13.28,20.4 C8.2 | 13.58,43.96 13.58,45.4 C13.2 | 13.58,43.96 v13.58,40.3 15.58,38.3 15.58,19.6 14.08,18.1 v14.08,15.4 | 38.08,65.3 38.08,58.4 40.68,55.8 R5.1 40.78,55.6 43.98,55.6 44.98,54.6 46.48,54.6 46.98,55.1 | 38.08,65.3 38.08,70.1 C18.2 | 38.08,65.3 v38.58,65.3 | 46.98,55.1 50.18,51.9 50.18,50 U1.P$1 50.18,49.8 48.18,47.8 47.78,47.8 45.88,45.9 45.88,45.8 | 45.88,45.8 44.48,45.8 U1.23 44.38,45.9 43.68,45.2 38.38,45.2 C14.2 38.58,45.1 v38.58,40.3 47.93,30.95 | v63.38,51.5 63.38,53.3 C1.1 | v63.38,47.8 63.38,45 C15.2 | v63.28,15.6 63.28,20.5 C11.2 | 47.93,30.95 50.48,33.5 50.48,34.5 Y2.2 | 47.93,30.95 38.38,21.4 38.38,20.3 C10.2 38.28,20.2 38.18,20.1 38.18,19.5 | 38.18,19.5 v38.18,15.7 | 49.63,26.65 42.48,19.5 38.18,19.5 | 49.63,26.65 v61.88,38.9 62.68,39.7 73.88,39.7 76.68,42.5 v76.68,44.2 76.78,44.3 v82.98,44.3 | 49.63,26.65 v60.88,15.4 | v35.88,40.4 33.58,42.7 14.84,42.7 13.58,43.96 | 62.38,71.2 58.58,75 57.58,75 ANALOGS.7 | 62.38,71.2 63.48,70.1 C19.2 | 62.08,66.1 65.88,69.9 65.88,70.6 65.18,71.3 62.48,71.3 62.38,71.2 | 62.08,66.1 61.58,65.6 58.58,65.6 55.28,62.3 55.28,62 C6.1 | 62.08,66.1 v62.38,65.8 | v63.38,90.6 63.38,95.1 C23.2 | v38.48,90.4 38.48,95.1 C22.2 38.28,95.2 37.48,96 | v13.38,65.5 13.38,69.9 C17.2 13.28,70.1 13.28,70.7 9.98,74 9.98,76 12.48,78.5 12.48,86.1 12.08,86.5 12.08,89.4 v13.28,90.6 13.28,95.1 C21.2 13.38,95.2 14.28,96.1 37.38,96.1 37.48,96 | 54.38,96.1 37.58,96.1 37.48,96 | 54.38,96.1 62.48,96.1 63.28,95.3 C23.2
  Bottom 0.305: 54.38,96.1 v54.38,91.4 | 98.08,86.2 99.08,85.2 99.08,80.4 95.48,76.8 R9.1 95.38,76.7 95.38,73.8 R8.1 95.28,73.7 91.48,69.9 88.28,69.9 C20.2 88.58,69.8 v88.58,65.3 88.68,65.2 88.68,64.7 91.88,61.5 91.88,45.9 v90.88,44.9 90.88,40.3 | 98.08,86.2 94.08,90.2 88.98,90.2 v88.88,90.3 88.48,90.7 88.48,95.2 C9.2 88.28,95.3 87.38,96.2 85.98,96.2 84.98,95.2 63.48,95.2 C23.2 | v98.18,86.3 98.08,86.2 | R6.1 95.08,24.1 91.28,20.3 88.18,20.3 C12.2 88.38,20.2 v88.38,15.5 | R6.1 95.18,24.2 95.18,27.3 R7.1 95.08,27.5 95.08,28.7 90.88,32.9 90.88,40.3 | v88.58,46.5 88.58,45.3 C16.2 | 90.88,40.3 v89.28,40.3 | R6.1 99.65,24.1 105.52,18.23 105.52,14.91 P1.2
  pour Bottom (hatched): -1.99,102.95 116.98,102.43 117.16,-1.27 -1.45,-1.1
HWB
  Bottom 0.305: U1.33 40.81,53.94 R5.2
MISO  (via drill 0.6)
  Top 0.305: v67.58,46.9 67.58,47.3 71.68,51.4 73.38,51.4 74.58,52.6 ICSP.1
  Bottom 0.305: v67.58,46.9 64.68,44 58.88,44 56.98,45.9 56.08,45.9 U1.11
MOSI  (via drill 0.6)
  Top 0.305: v64.78,46.7 v57.48,46.7
  Bottom 0.305: v57.48,46.7 56.08,46.7 U1.10 | v64.78,46.7 65.98,47.9 69.98,47.9 72.08,50 ICSP.4
N$1
  Bottom 0.305: D1.2 22.98,5.1 14.28,5.1 11.58,7.8 B1.SIG2A
N$2  (via drill 0.6)
  Top 0.305: v112.78,69.9 112.78,73.4 LED1.C
  Bottom 0.305: R10.2 103.77,72.31 104.1,72.64 104.1,73.79 104.71,74.39 109.4,74.39 110.92,72.88 110.92,71.76 v112.78,69.9
N$3
  Bottom 0.305: D1.1 24.98,5.1 31.18,5.1 33.88,7.8 36.48,7.8 B1.SIG2E
N$4  (via drill 0.6)
  Top 0.305: v111.58,74.4 112.78,75.6 LED2.C
  Bottom 0.305: R11.2 103.67,74.51 104.13,74.97 111.01,74.97 v111.58,74.4
N$5
  Bottom 0.305: D2.2 73.98,5.6 63.78,5.6 61.58,7.8 B1.SIG2I
N$6
  Bottom 0.305: D2.1 75.98,5.6 81.68,5.6 83.88,7.8 86.48,7.8 B1.SIG2M
N$7  (via drill 0.6)
  Top 0.305: v16.58,29.5 14.98,29.5 14.38,28.9 v13.98,28.9
  Bottom 0.305: v16.58,29.5 D3.2 | v13.98,28.9 13.98,30.4 11.58,32.8 B1.SIG2B
N$8
  Bottom 0.305: D3.1 29.58,29.5 35.28,35.2 35.88,35.2 36.58,34.5 36.58,32.9 B1.SIG2F
N$9
  Bottom 0.305: D4.2 73.68,29.8 69.28,29.8 62.98,36.1 62.38,36.1 61.58,35.3 61.58,32.9 B1.SIG2J
N$10
  Bottom 0.305: D4.1 75.68,29.8 82.58,29.8 85.58,32.8 86.48,32.8 B1.SIG2N
N$11  (via drill 0.6)
  Top 0.305: v19.98,58.3 15.88,54.2 v15.18,54.2
  Bottom 0.305: v19.98,58.3 19.98,61 23.98,65 23.98,68.8 D5.2 | v15.18,54.2 11.58,57.8 B1.SIG2C
N$12
  Bottom 0.305: D5.1 25.98,68.8 25.98,65 27.48,63.5 27.48,60.8 25.38,58.7 25.38,56.8 26.08,56.1 31.08,56.1 32.78,57.8 36.48,57.8 B1.SIG2G
N$13
  Bottom 0.305: D6.2 71.58,68.9 62.38,59.7 62.28,59.7 61.58,59 61.58,57.9 B1.SIG2K
N$14  (via drill 0.6)
  Top 0.305: v78.18,62.8 78.18,60 v80.18,58
  Bottom 0.305: v78.18,62.8 75.88,65.1 75.88,68.9 D6.1 | v80.18,58 86.38,58 86.48,57.9 B1.SIG2O
N$15
  Bottom 0.305: D8.2 73.68,79.6 69.28,79.6 62.88,86 62.88,86.2 62.18,86.9 61.58,86.9 60.88,86.2 60.88,85.2 61.58,84.5 61.58,82.9 B1.SIG2L
N$16
  Bottom 0.305: D8.1 75.68,79.6 77.28,79.6 80.48,82.8 86.48,82.8 B1.SIG2P
N$17  (via drill 0.6)
  Top 0.305: v15.38,79.3 13.98,79.3 13.48,78.8 v11.48,78.8
  Bottom 0.305: v15.38,79.3 23.88,79.3 D7.2 | v11.48,78.8 11.48,82.8 B1.SIG2D
N$18
  Bottom 0.305: D7.1 25.88,79.4 25.88,80.2 28.48,82.8 36.48,82.8 B1.SIG2H
N$19  (via drill 0.6)
  Top 0.305: B1.1A 10.08,14.7 v10.68,15.3 | v11.88,36.8 10.48,36.8 10.08,37.2 B1.2B
  Bottom 0.305: v10.68,15.3 10.68,21.4 8.48,23.6 8.48,33.4 v11.88,36.8
N$20  (via drill 0.6)
  Top 0.305: v36.78,13.1 35.98,12.3 35.08,12.3 B1.2E | v37.48,36.8 37.48,37 35.58,38.9 35.08,38.9 B1.1F
  Bottom 0.305: v36.78,13.1 36.78,13.6 34.38,16 34.38,27.1 37.48,30.2 v37.48,36.8
N$21  (via drill 0.6)
  Top 0.305: v38.48,34.3 35.58,37.2 35.08,37.2 B1.2F | v27.18,32.4 27.18,36.4 27.48,36.7 27.48,44.5 25.78,46.2 25.78,56.5 v26.38,57.1 | v35.68,65.3 35.68,64.6 35.08,64 B1.1G
  Bottom 0.305: v38.48,34.3 38.48,37.1 37.78,37.8 32.58,37.8 v27.18,32.4 | v26.38,57.1 34.58,65.3 v35.68,65.3
N$22  (via drill 0.6)
  Top 0.305: B1.1B 10.08,39.7 v10.68,40.3 | v11.18,59.2 11.58,59.2 12.88,60.5 12.88,61.1 11.78,62.2 10.08,62.2 B1.2C
  Bottom 0.305: v10.68,40.3 10.68,57.2 10.48,57.4 10.48,58.5 v11.18,59.2
N$23  (via drill 0.6)
  Top 0.305: B1.1C 10.08,64.7 v10.68,65.3 | v9.98,71.9 9.98,76 11.78,77.8 v13.38,77.8 | v13.48,84.3 10.58,87.2 10.08,87.2 B1.2D
  Bottom 0.305: v10.68,65.3 10.68,69.2 9.98,69.9 v9.98,71.9 | v13.38,77.8 13.38,84.2 v13.48,84.3
N$24  (via drill 0.6)
  Top 0.305: v36.88,62.2 35.08,62.2 B1.2G | v29.68,59.1 29.68,60.2 29.38,60.5 v29.38,84.4 | v35.68,90.3 35.68,89.6 35.08,89 B1.1H
  Bottom 0.305: v36.88,62.2 32.78,62.2 v29.68,59.1 | v29.38,84.4 29.78,84.4 v35.68,90.3
N$25  (via drill 0.6)
  Top 0.305: v61.88,64 60.08,64 B1.1K | v61.88,85.9 60.58,87.2 60.08,87.2 B1.2L
  Bottom 0.305: v61.88,64 66.48,68.6 66.48,81.3 v61.88,85.9
N$26  (via drill 0.6)
  Top 0.305: B1.1J 60.08,39.7 v60.68,40.3 | v52.48,38.9 52.48,43.9 46.28,50.1 46.28,51.8 50.18,55.7 v55.28,55.7 | v61.88,61.8 60.48,61.8 60.08,62.2 B1.2K
  Bottom 0.305: v60.68,40.3 55.78,40.3 54.38,38.9 v52.48,38.9 | v55.28,55.7 55.88,55.7 61.88,61.7 v61.88,61.8
N$27  (via drill 0.6)
  Top 0.305: v63.08,14 60.08,14 B1.1I | v62.68,35.1 60.58,37.2 60.08,37.2 B1.2J
  Bottom 0.305: v63.08,14 64.98,15.9 64.98,32.8 v62.68,35.1
N$28  (via drill 0.6)
  Top 0.305: v88.78,59 85.58,62.2 85.08,62.2 B1.2O | v89.48,54 90.68,54 95.58,58.9 95.58,66 89.68,71.9 v85.18,71.9 | v86.88,88.6 85.38,88.6 85.08,88.9 B1.1P
  Bottom 0.305: v88.78,59 88.78,54.7 v89.48,54 | v85.18,71.9 85.18,74.2 84.98,74.4 84.98,79.4 88.18,82.6 88.18,87.3 v86.88,88.6
N$29  (via drill 0.6)
  Top 0.305: v88.08,39.8 88.18,39.7 88.18,38.1 87.48,37.4 86.48,37.4 86.38,37.3 85.08,37.3 B1.2N | v87.48,62 85.58,63.9 85.08,63.9 B1.1O
  Bottom 0.305: v88.08,39.8 88.08,43.1 89.88,44.9 89.88,52.3 87.48,54.7 v87.48,62
N$30  (via drill 0.6)
  Top 0.305: v88.08,14 86.38,12.3 85.08,12.3 B1.2M | v92.98,26 v92.98,18.7 | v87.18,38.4 85.58,38.4 85.08,38.9 B1.1N
  Bottom 0.305: v88.08,14 88.28,14 v92.98,18.7 | v92.98,26 90.58,28.4 90.58,32.4 88.78,34.2 88.78,36.8 v87.18,38.4
PMOS_A  (via drill 0.6)
  Top 0.305: v57.48,54 57.48,53.4 59.08,51.8 59.08,49.6 54.38,44.9 v54.38,34.9 | v41.98,22.5 36.48,22.5 28.18,30.8 28.18,45.1 v27.78,45.5
  Bottom 0.305: Q2.2 25.58,48.5 25.58,49.2 26.38,50 27.28,50 27.78,49.5 27.78,46.2 27.43,45.85 v27.78,45.5 | v57.48,54 56.08,54 U1.1 | v41.98,22.5 v54.38,34.9
PMOS_B  (via drill 0.6)
  Top 0.305: v54.58,47.2 54.58,48 v58.08,51.5 | v60.38,51.9 62.38,53.9 75.08,53.9 75.88,53.1 75.88,51.3 74.68,50.1 ICSP.3 74.88,50.1 v78.68,46.3 | v15.68,48.4 12.28,48.4 4.38,40.5 4.38,8.9 9.18,4.1 65.78,4.1 70.58,8.9 v70.58,19.2 | v67.98,29.8 67.98,31.3 72.48,35.8 72.48,38.5 76.58,42.6 77.68,42.6 v81.38,46.3
  Bottom 0.305: v54.58,47.2 54.88,47.5 55.98,47.5 U1.9 | v58.08,51.5 59.98,51.5 v60.38,51.9 | v15.68,48.4 22.98,48.4 Q2.4 | v70.58,19.2 70.58,27.2 v67.98,29.8 | v78.68,46.3 v81.38,46.3
QA  (via drill 0.6)
  Top 0.305: v39.38,52.9 39.38,52.2 38.08,50.9 36.18,50.9 v31.68,55.4 | v18.38,55.4 17.88,55.4 15.68,53.2 10.28,53.2 v9.58,53.9 | v6.88,28.9 v9.48,28.9
  Bottom 0.305: v39.38,52.9 39.58,53.1 44.38,53.1 U1.32 | v18.38,55.4 v31.68,55.4 | 7.18,28.9 7.18,51.5 v9.58,53.9 9.58,55.1 9.48,55.2 B1.SIG1C 9.38,55.4 8.78,56 8.78,76.4 9.38,77 9.38,80.2 B1.SIG1D | 7.18,28.9 7.18,16.7 9.38,14.5 9.38,5.3 B1.SIG1A | v9.48,28.9 9.48,30.2 B1.SIG1B | 7.18,28.9 v6.88,28.9
QB  (via drill 0.6)
  Top 0.305: v32.68,5.3 32.68,5.6 29.38,8.9 v29.38,25.2 | v35.68,54 v37.78,51.9 | v28.38,60.4 28.38,56.9 v30.88,54.4 | v32.68,30.3 32.68,30.6 29.38,33.9 29.38,42.7 v34.18,47.5
  Bottom 0.305: v32.68,5.3 34.38,5.3 B1.SIG1E | 33.58,29.4 34.38,30.2 B1.SIG1F | 33.58,29.4 v29.38,25.2 | v37.78,51.9 42.48,51.9 42.88,52.3 44.38,52.3 U1.31 | 35.18,54.5 34.48,55.2 B1.SIG1G | 35.18,54.5 v35.68,54 | v28.38,60.4 34.38,66.4 34.38,80.2 B1.SIG1H | 34.18,54.4 35.08,54.4 35.18,54.5 | 34.18,54.4 v30.88,54.4 | v32.68,30.3 33.58,29.4 | 34.18,54.4 v34.18,47.5
QC  (via drill 0.6)
  Top 0.305: v49.18,51.5 50.18,52.5 50.28,52.5 52.48,54.7 53.48,54.7 | 53.48,54.7 56.88,54.7 57.18,55 57.88,55 v58.78,54.1 | v54.38,25.2 54.38,21.5 | 54.38,21.5 v54.38,9.9 | v43.18,80.2 42.68,80.2 39.98,77.5 35.18,77.5 v30.38,72.7 | v27.28,69.6 22.48,64.8 22.48,35.7 36.68,21.5 54.38,21.5 | 53.48,54.7 53.48,35.3 53.38,35.2 53.38,34.6 v58.18,29.8
  Bottom 0.305: v49.18,51.5 44.48,51.5 U1.30 | v58.78,54.1 58.78,54.6 59.38,55.2 B1.SIG1K | v54.38,9.9 58.98,5.3 59.38,5.3 B1.SIG1I | 58.58,29.4 59.38,30.2 B1.SIG1J | 58.58,29.4 v54.38,25.2 | v43.18,80.2 59.38,80.2 B1.SIG1L | v27.28,69.6 v30.38,72.7 | 58.58,29.4 v58.18,29.8
QD  (via drill 0.6)
  Top 0.305: v45.88,48.1 45.88,40 57.08,28.8 75.48,28.8 | v78.08,28.8 75.48,28.8 | v78.38,9.6 v82.68,5.3 | v83.68,46.3 77.48,40.1 77.48,34 75.48,32 75.48,28.8 | v71.48,69.9 71.48,60.6 v76.78,55.3
  Bottom 0.305: v45.88,48.1 45.88,49.9 45.08,50.7 44.48,50.7 U1.29 | B1.SIG1N 84.38,30.2 82.98,28.8 v78.08,28.8 78.38,28.7 v78.38,9.6 | v82.68,5.3 84.38,5.3 B1.SIG1M | v83.68,46.3 84.38,47 84.38,55.2 B1.SIG1O 84.28,55.3 v76.78,55.3 | v71.48,69.9 81.78,80.2 84.38,80.2 B1.SIG1P
RD+  (via drill 0.6)
  Top 0.305: v101.68,92.6 105.98,92.6 R2.2 | v91.68,95.9 83.98,95.9 77.48,89.4 77.48,83.8 71.68,78 v71.68,77.1 | v64.88,70.3 v67.48,72.9 | v52.58,61.9 52.58,59.4 v46.98,53.8 | v48.28,52.5 48.98,52.5 v49.98,53.5
  Bottom 0.305: v101.68,92.6 94.98,92.6 v91.68,95.9 | v67.48,72.9 v71.68,77.1 | v64.88,70.3 64.88,69.7 61.38,66.2 56.88,66.2 v52.58,61.9 | v48.28,52.5 v46.98,53.8 | v49.98,53.5 51.08,53.5 52.98,51.6 55.98,51.6 U1.4
RD-  (via drill 0.6)
  Top 0.305: v102.38,90.6 105.98,90.6 R4.2 | v90.88,94.9 89.98,94.9 89.58,95.3 84.18,95.3 79.08,90.2 v79.08,80.1 | v70.78,71.8 70.78,70.5 69.38,69.1 v69.38,68
  Bottom 0.305: v102.38,90.6 95.18,90.6 v90.88,94.9 | v70.78,71.8 v79.08,80.1 | v69.38,68 55.98,54.6 55.18,54.6 54.88,54.3 54.88,52.8 55.28,52.4 55.98,52.4 U1.3
RESET  (via drill 0.6)
  Top 0.305: v71.08,44.2 71.28,44.2 73.48,46.4 | 73.48,46.4 74.58,47.5 ICSP.5 | 73.48,46.4 v75.38,44.5 | v82.58,47.5 89.58,47.5 95.58,41.5 95.58,16.27 99.26,12.59 99.26,5.61 100.67,4.19 111.87,4.19 111.88,4.2 112.48,4.2 S1.2
  Bottom 0.305: D16.A 74.18,41.6 74.18,44 R3.1 74.98,44.1 v75.38,44.5 | v71.08,44.2 70.28,43.4 58.68,43.4 57.38,44.7 56.58,44.7 55.98,45.3 53.88,45.3 53.48,44.9 53.48,44.2 U1.13 | v82.58,47.5 74.68,47.5 ICSP.5
RXLED  (via drill 0.6)
  Top 0.305: v59.28,45.7 65.38,45.7 67.88,43.2 76.98,43.2 86.48,52.7 89.59,52.7 90.22,53.33 91.13,53.33 101.37,63.58 v101.37,66.83
  Bottom 0.305: v59.28,45.7 59.28,46.2 57.18,48.3 56.08,48.3 U1.8 | v101.37,66.83 99.79,66.83 98.19,68.42 98.19,72.79 99.89,74.48 101.18,74.48 R11.1
S1  (via drill 0.6)
  Top 0.305: v60.18,72.1 65.38,72.1 68.48,75.2 69.08,75.2 69.78,74.5 69.78,70.8 68.38,69.4 68.38,67.7 70.88,65.2 70.88,59.9 77.88,52.9 v85.38,52.9 | v88.88,49.4 88.88,49 102.99,34.89 P1.1
  Bottom 0.305: v60.18,72.1 51.58,63.5 51.58,61.6 51.78,61.4 51.78,55.8 U1.41 | v88.88,49.4 v85.38,52.9
T1  (via drill 0.6)
  Top 0.305: v37.28,39.4 39.38,37.3 39.88,37.3 B1.5F | v63.08,37.2 64.88,37.2 B1.5J | v87.18,35 89.38,37.2 89.88,37.2 B1.5N | v13.08,13.6 14.38,12.3 14.88,12.3 B1.5A | v13.08,35.9 14.38,37.2 14.88,37.2 B1.5B | v37.68,12.2 39.88,12.2 B1.5E | v61.38,9.2 64.38,12.2 64.88,12.2 B1.5I | v85.78,9.1 88.88,12.2 89.88,12.2 B1.5M | v25.18,31.7 20.08,31.7 16.08,27.7 v14.58,27.7
  Bottom 0.305: Q2.7 25.58,53.6 26.68,53.6 Q2.8 26.88,53.6 28.38,52.1 28.38,48.7 31.58,45.5 32.08,45.5 37.28,40.3 v37.28,39.4 37.18,39.3 32.78,39.3 v25.18,31.7 | v63.08,37.2 71.78,37.2 73.98,35 v87.18,35 87.28,34.9 87.28,33.5 87.48,33.3 87.48,28.5 84.98,26 84.98,9.1 | 14.98,27.7 14.98,34 v13.08,35.9 | 14.98,27.7 14.98,19.8 13.08,17.9 v13.08,13.6 16.68,10 34.98,10 35.88,10.9 | v37.68,12.2 37.18,12.2 35.88,10.9 | 35.88,10.9 42.48,4.3 59.88,4.3 60.48,4.9 60.48,8.3 v61.38,9.2 61.48,9.1 75.38,9.1 75.88,8.6 78.68,8.6 79.18,9.1 84.98,9.1 | 84.98,9.1 v85.78,9.1 | 14.98,27.7 v14.58,27.7
T2  (via drill 0.6)
  Top 0.305: v63.08,87.3 64.88,87.3 B1.5L | v87.18,86 88.18,86 89.38,87.2 89.88,87.2 B1.5P | v64.08,59.2 63.38,59.9 63.38,61.2 64.38,62.2 64.88,62.2 B1.5K | v77.38,59.2 v74.18,59.2 72.48,60.9 72.48,72.6 69.58,75.5 69.58,78.1 | v88.18,63.1 88.58,63.1 89.38,62.3 89.88,62.3 B1.5O | 69.58,78.1 v69.58,80.6 | v36.88,64.8 39.38,62.3 39.88,62.3 B1.5G | v38.08,85.1 38.08,85.9 39.38,87.2 39.88,87.2 B1.5H | v13.08,62.2 14.88,62.2 B1.5C | v13.08,86.8 13.18,86.8 13.58,87.2 14.88,87.2 B1.5D | v55.78,78.1 69.58,78.1 | v42.08,78.1 41.68,78.1 v40.08,76.5
  Bottom 0.305: v63.08,87.3 71.68,87.3 73.98,85 | 73.98,85 86.18,85 v87.18,86 | v74.18,59.2 v64.08,59.2 | v77.38,59.2 77.88,59.2 81.78,63.1 v88.18,63.1 | v69.58,80.6 73.98,85 | v36.88,64.8 36.88,67.9 34.98,69.8 34.98,79.4 35.88,80.3 | 36.08,80.5 38.08,82.5 v38.08,85.1 | 36.08,80.5 35.88,80.3 | v13.08,86.8 13.08,86 14.68,84.4 14.68,79.9 14.38,79.6 14.38,76.6 18.28,72.7 | 18.28,72.7 18.28,67.4 v13.08,62.2 13.08,59.4 18.78,53.7 22.98,53.7 Q2.5 23.08,53.6 24.28,53.6 Q2.6 | 35.88,80.3 34.88,81.3 29.58,81.3 21.08,72.8 18.38,72.8 18.28,72.7 | v42.08,78.1 v55.78,78.1 | 36.08,80.5 v40.08,76.5
TXLED  (via drill 0.6)
  Top 0.305: v94.58,30.5 94.58,29.2 92.88,27.5 78.88,27.5 73.88,22.5 61.28,22.5 v46.28,37.5
  Bottom 0.305: v94.58,30.5 105.68,41.6 105.68,66.42 103.77,68.33 100.22,68.33 99.56,69 99.56,71.24 100.62,72.31 R10.1 | v46.28,37.5 46.28,44.1 U1.22
UCAP
  Bottom 0.305: U1.6 56.08,49.9 64.18,49.9 64.98,49.1 65.38,49.1 C7.2
UGND  (via drill 0.6)
  Top 0.305: 103.68,96.5 L2.1 105.88,96.5 106.88,97.5 108.68,97.5 108.98,97.2 108.98,95.08 109.63,94.43 109.63,93.23 v109.66,93.2 111.38,93.2 X1.P5 | v85.18,70.3 88.78,70.3 v89.38,70.9 | v102.38,83.9 v92.28,73.8 | X1.P$8 112.97,94.67 113.66,95.36 115.38,95.36 X1.P$5 | X1.S2 X1.S6 X1.S5 X1.S1 | X1.P$1 112.97,88.87 113.12,88.72 115.07,88.72 X1.P$4
  Top 0.406: 103.68,96.5 103.58,96.5 JMP1.1
  Bottom 0.305: 56.08,50.8 U1.5 56.18,50.7 57.58,50.7 57.78,50.5 65.18,50.5 65.38,50.7 C7.1 65.48,50.8 67.48,50.8 85.18,68.5 v85.18,70.3 | v92.28,73.8 v89.38,70.9 | v102.38,83.9 102.38,84.36 109.62,91.59 109.62,93.15 v109.66,93.2
  pour Top (hatched): 119.45,96.16 119.34,87.7 110.58,87.63 110.46,96.14
VCC  (via drill 0.6)
  Top 0.305: B1.3G 35.08,60.5 36.28,59.3 v36.48,59.3 36.58,59.2 v39.38,59.2 | v59.48,70.1 47.28,70.1 42.38,75 ANALOGS.1 | v36.88,85.6 35.08,85.6 B1.3H | B1.3L 60.08,84.7 v60.58,84.2 | v61.88,11 60.48,11 60.08,10.6 B1.3I | B1.3J 60.08,34.7 v60.58,34.2 | v37.48,10.7 35.18,10.7 35.08,10.6 B1.3E | B1.3F 35.08,34.7 v35.58,34.2 | v36.28,27.7 v34.98,29 34.88,29.1 32.58,29.1 28.78,32.9 28.78,45.8 28.18,46.4 | v10.58,34.2 10.58,35 10.08,35.5 B1.3B | v11.48,84.3 11.28,84.3 10.08,85.5 B1.3D | v11.88,10.6 10.08,10.6 B1.3A | v8.18,22.6 v9.48,23.9 | 28.18,46.4 28.08,46.5 v26.78,46.5 | v31.88,46.5 28.28,46.5 28.18,46.4 | v89.38,84.2 87.68,84.2 86.38,85.5 85.08,85.5 B1.3P | v98.08,84.9 105.48,84.9 P1.3 105.58,84.8 114.78,75.6 LED2.A 114.98,75.6 114.98,73.5 LED1.A | v62.58,58.7 60.78,60.5 60.08,60.5 B1.3K | B1.3O 85.08,59.7 v85.68,59.1 | v59.78,48.9 59.78,49.2 62.08,51.5 | 62.08,51.5 63.18,52.6 72.08,52.6 ICSP.2 | 62.08,51.5 v61.68,51.9 | v86.78,11.4 86.38,11.4 85.58,10.6 85.08,10.6 B1.3M | v86.78,36.4 85.98,35.6 85.08,35.6 B1.3N | v90.88,52.1 90.28,52.1 v86.88,48.7 | v45.18,55.7 45.18,50.1 48.28,47 v48.28,46.8 | v11.88,60.8 11.68,60.6 10.08,60.6 B1.3C
  Bottom 0.305: C4.1 44.22,57.72 44.88,57.06 45.52,57.06 46.16,56.42 46.16,55.78 U1.34 46.08,55.7 v45.18,55.7 | C4.1 44.18,58.78 C3.1 43.86,61.37 L1.1 43.78,63.9 43.78,64.4 39.08,69.1 39.08,72.7 38.98,72.8 | C5.2 53.94,40.26 53.94,41.16 53.58,41.52 52.86,41.52 52.6,41.78 U1.14 52.68,44.2 52.68,46.6 52.78,46.7 | 36.68,46.5 36.68,56.6 37.48,57.4 37.48,58.3 v36.48,59.3 | 36.68,46.5 36.68,45.2 C14.1 | 41.18,75 38.98,72.8 | 38.98,72.8 36.38,70.2 C18.1 | 41.18,75 42.28,75 ANALOGS.1 | v59.48,70.1 61.78,70.1 C19.1 | 41.08,84 38.18,86.9 | 38.18,86.9 36.78,88.3 36.78,95.1 C22.1 | 41.08,84 41.08,75.1 41.18,75 | 54.53,90.25 48.38,84.1 41.18,84.1 41.08,84 | 54.53,90.25 59.38,95.1 61.58,95.1 C23.1 | 38.18,86.9 v36.88,85.6 | 54.53,90.25 v60.58,84.2 | v39.38,59.2 44.08,59.2 C4.1 | v60.58,34.2 60.58,33.3 60.48,33.2 60.48,26.5 59.98,26 59.98,22.1 61.48,20.6 C11.1 61.58,20.5 61.58,16 62.08,15.5 62.08,13.4 62.88,12.6 62.88,12 v61.88,11 61.78,11.1 38.08,11.1 37.98,11.2 | v37.48,10.7 37.98,11.2 | 37.98,11.2 38.68,11.9 38.68,12.5 36.68,14.5 36.68,20.3 C10.1 36.58,20.4 34.98,22 34.98,26 36.28,27.3 v36.28,27.7 | v35.58,34.2 35.58,33.3 35.48,33.2 35.48,29.5 v34.98,29 | 9.98,24 11.58,22.4 11.58,20.5 C8.1 | 9.98,24 9.98,28.1 10.48,28.6 10.48,34.1 v10.58,34.2 | C21.1 11.48,95.1 v11.48,84.3 10.48,83.3 10.48,77.3 9.38,76.2 9.38,73.8 11.58,71.6 11.58,70.1 C17.1 11.58,69.8 11.88,69.5 v11.88,60.8 11.98,60.7 11.98,59.7 16.18,55.5 16.18,50.2 | 26.23,47.05 26.78,47.6 26.78,48.4 Q2.1 | 26.23,47.05 26.08,46.9 25.08,46.9 24.38,47.6 24.38,48.4 Q2.3 24.28,48.6 24.28,49.2 23.38,50.1 16.28,50.1 16.18,50.2 | v11.88,10.6 11.88,11 9.98,12.9 9.98,14.7 7.88,16.8 7.88,22.6
  Bottom 0.305: 7.88,22.6 7.88,36.2 11.68,40 11.68,45.4 C13.1 11.68,45.7 16.18,50.2 | v9.48,23.9 9.88,23.9 9.98,24 | 7.88,22.6 v8.18,22.6 | 26.23,47.05 v26.78,46.5 | v31.88,46.5 36.68,46.5 | 89.98,84.9 89.98,87.9 86.78,91.1 86.78,95.2 C9.1 | 89.98,84.9 89.98,84.2 | 89.98,84.2 89.98,74 86.58,70.6 86.58,69.9 C20.1 86.58,69.7 86.58,66 90.88,61.7 v90.88,52.1 | 89.98,84.2 v89.38,84.2 | P1.3 105.48,84.8 105.48,82.6 104.58,81.7 104.58,78.9 106.68,76.8 F1.1 | v98.08,84.9 89.98,84.9 | C1.2 61.58,53.3 59.28,53.3 58.98,53 56.18,53 56.08,53.1 U1.2 | v62.58,58.7 62.58,54.3 61.68,53.4 C1.2 | C15.1 61.28,45 58.58,47.7 | 58.58,47.7 57.18,49.1 56.08,49.1 U1.7 55.88,49.1 55.18,49.1 52.78,46.7 | v85.68,59.1 78.58,59.1 72.18,52.7 ICSP.2 72.18,52.5 72.18,51.8 73.48,50.5 73.48,45.4 73.58,45.3 | v59.78,48.9 58.58,47.7 | v61.68,51.9 61.68,53.2 C1.2 | v86.78,11.4 86.48,11.7 86.48,20.2 C12.1 86.58,20.3 86.58,20.6 89.98,24 89.98,32.2 88.18,34 88.18,35.3 86.88,36.6 v86.78,36.4 86.78,37.5 86.18,38.1 86.18,45.3 | D16.C 72.28,41.6 72.28,44.1 R3.2 72.48,44.2 73.58,45.3 | 86.18,45.3 75.88,45.3 75.68,45.5 73.78,45.5 73.58,45.3 | 86.18,45.3 86.78,45.3 C16.1 86.88,45.4 v86.88,48.7 | v48.28,46.8 52.68,46.8 52.78,46.7
XTAL3
  Bottom 0.305: U1.16 51,39.06 51.42,38.64 R1.2 51.54,37.55 Y2.1
XTAL4
  Bottom 0.305: U1.17 50.2,39 49.74,38.54 R1.1 49.54,37.47 Y2.3
XUSB  (via drill 0.6)
  Top 0.305: v106.78,86 111.28,90.5 112.78,90.5 112.88,90.6 X1.P1
  Bottom 0.305: v106.78,86 106.78,80.6 F1.2

### Text on the board
tNames: X1